# EAGLE design SUDEPDEVICE (EAGLE 9.6.2)
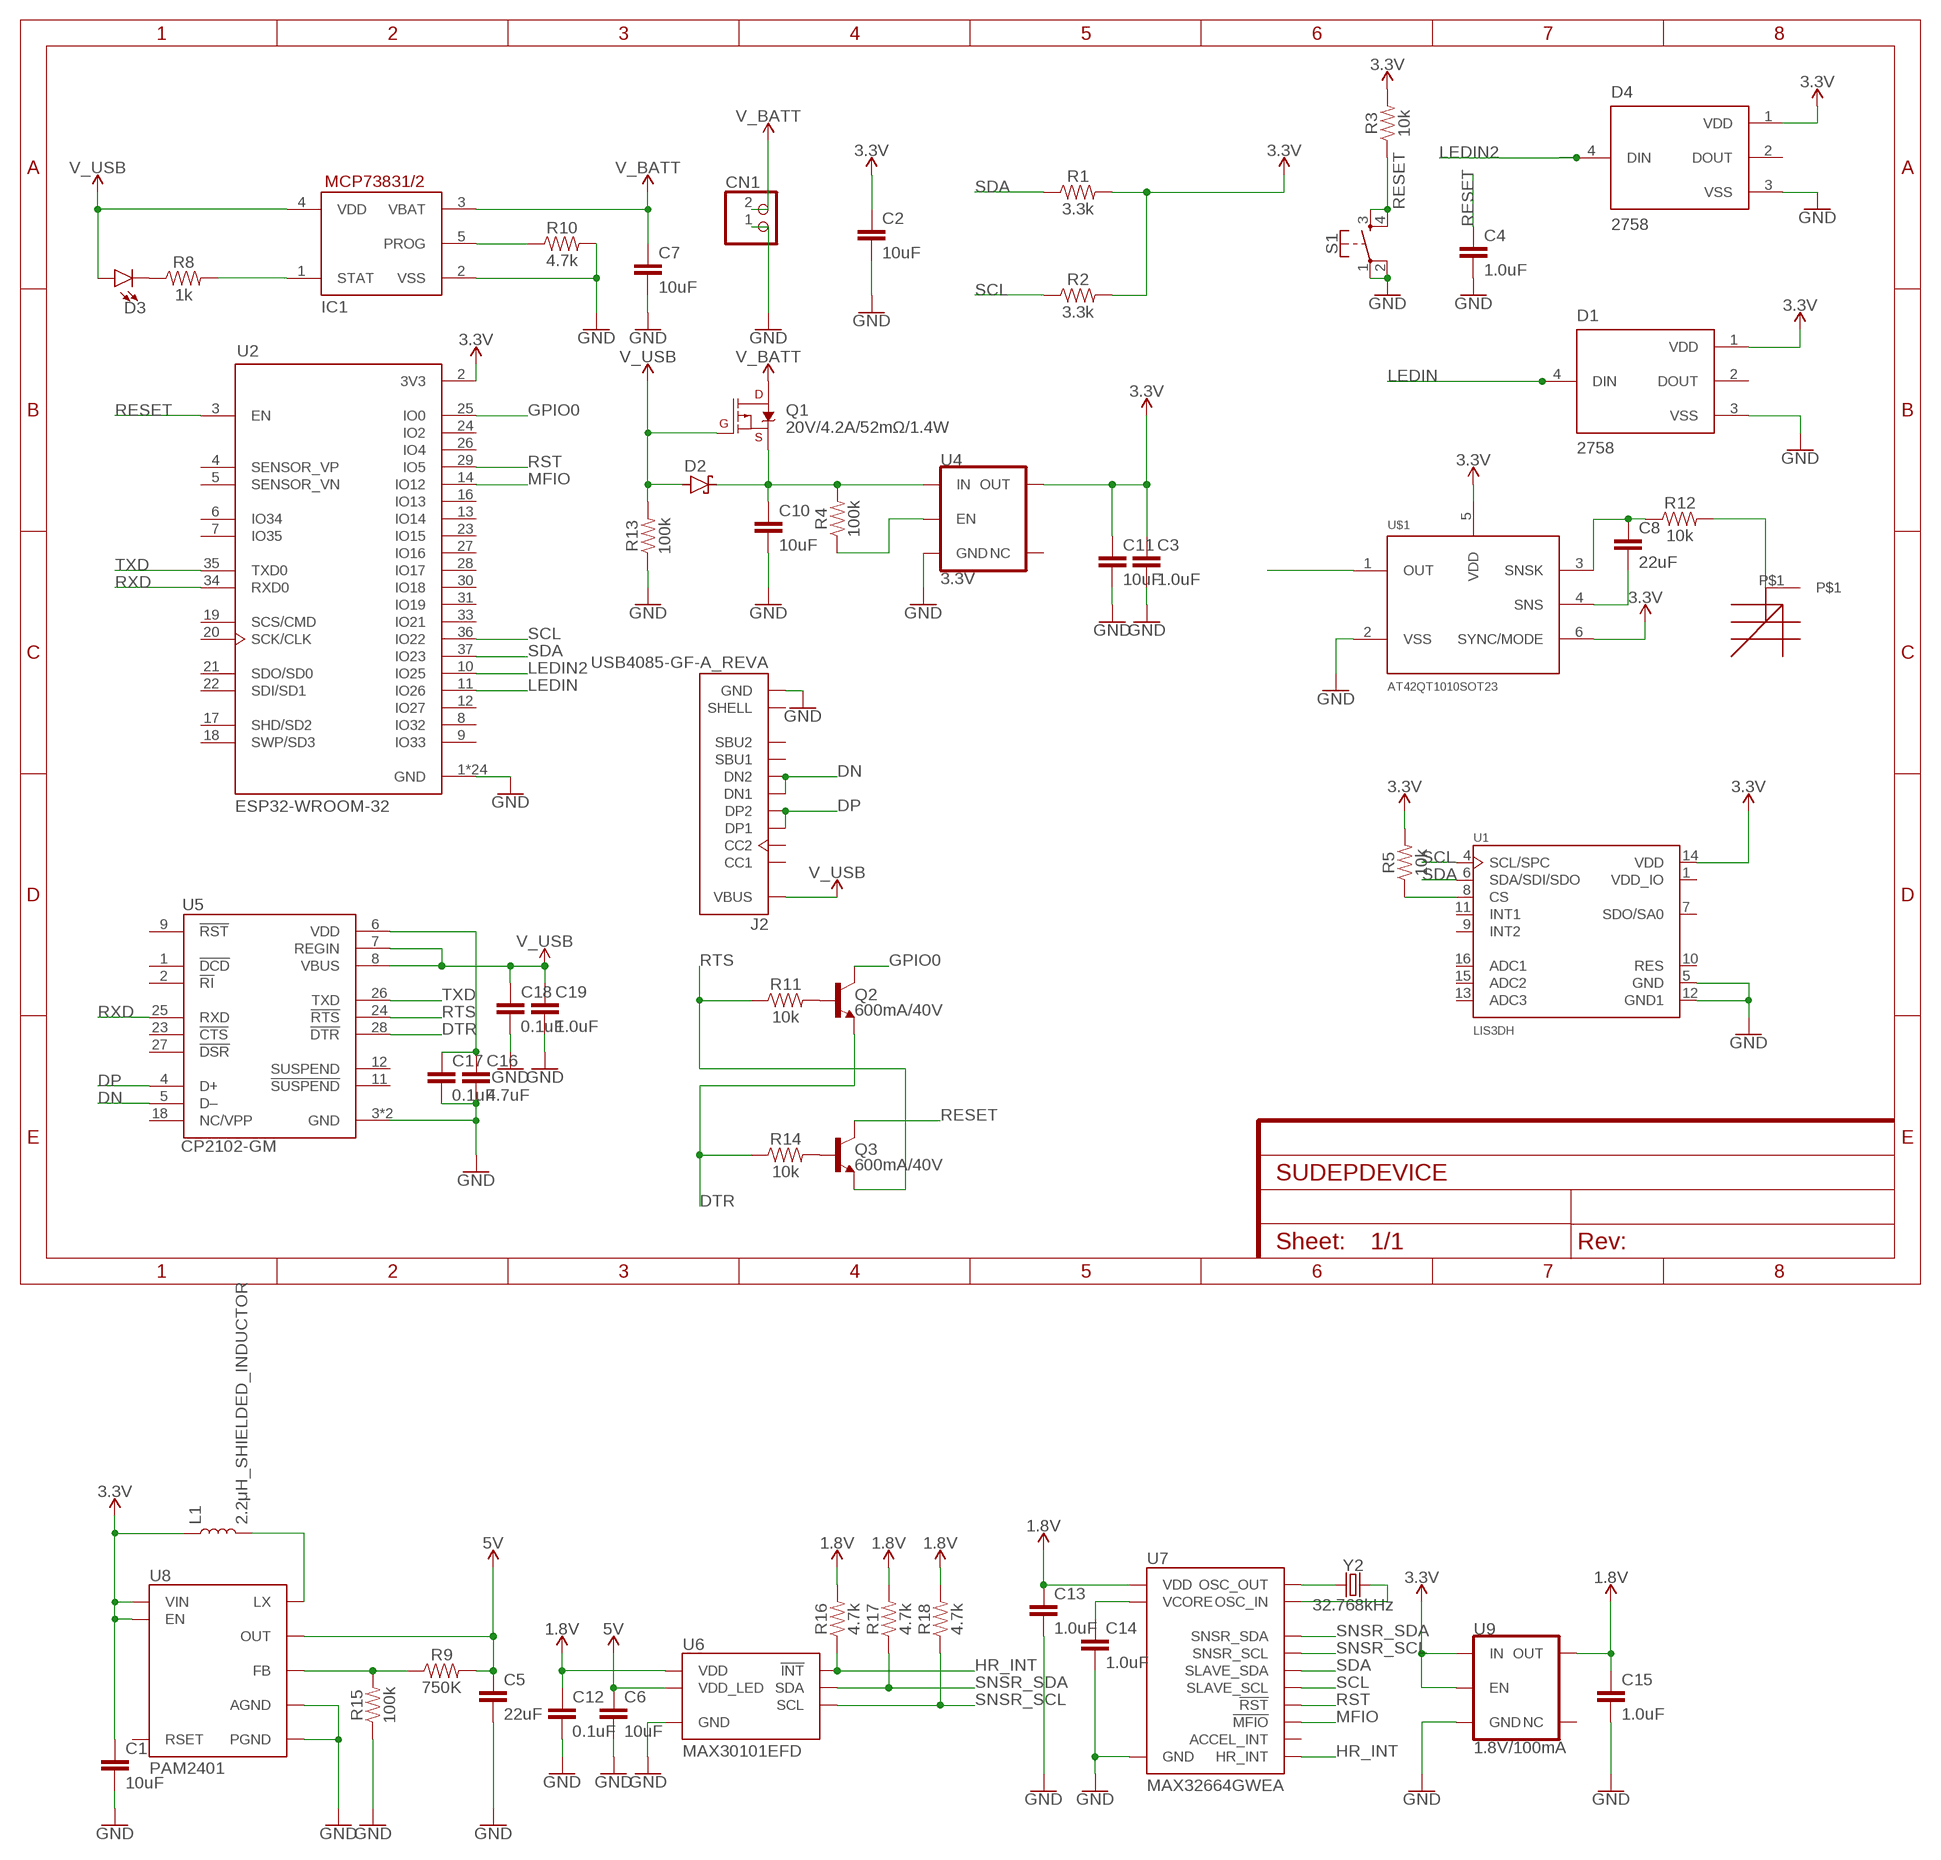
[diagram p0: schematic, sheet 1]

## Parts
C1  10uF  10UF-0603-6.3V-20%  [0603]
C2  10uF  10UF-0603-6.3V-20%  [0603]
C3  1.0uF  1.0UF-0603-16V-10%  [0603]
C4  1.0uF  1.0UF-0603-16V-10%  [0603]
C5  22uF  22UF-0603-6.3V-20%  [0603]
C6  10uF  10UF-0603-6.3V-20%  [0603]
C7  10uF  10UF-0603-6.3V-20%  [0603]
C8  22uF  22UF-0603-6.3V-20%  [0603]
C10  10uF  10UF-0603-6.3V-20%  [0603]
C11  10uF  10UF-0603-6.3V-20%  [0603]
C12  0.1uF  0.1UF-0603-25V-5%  [0603]
C13  1.0uF  1.0UF-0603-16V-10%  [0603]
C14  1.0uF  1.0UF-0603-16V-10%  [0603]
C15  1.0uF  1.0UF-0603-16V-10%  [0603]
C16  4.7uF  4.7UF-0603-6.3V-(10%)  [0603]
C17  0.1uF  0.1UF-0603-25V-(+80/-20%)  [0603]
C18  0.1uF  0.1UF-0603-25V-(+80/-20%)  [0603]
C19  1.0uF  1.0UF-0603-16V-10%  [0603]
CN1  JST_2PIN-SMT-RA  [JST-PH-2-SMT-RA]
D1  2758  [SOL320P540X170-4N]
D2  SCHOTTKY-DIODESMD  [SMB]
D3  LED0603  [LED-0603]
D4  2758  [SOL320P540X170-4N]
IC1  MCP73831/OT  [SOT23-5L]
J2  USB4085-GF-A_REVA  [GCT_USB4085-GF-A_REVA]
L1  2.2μH_SHIELDED_INDUCTOR  [0806]
Q1  20V/4.2A/52mΩ/1.4W  MOSFET_PCH-DMG2305UX-7  [SOT23-3]
Q2  600mA/40V  TRANS_NPN-MMBT2222AL  [SOT23-3]
Q3  600mA/40V  TRANS_NPN-MMBT2222AL  [SOT23-3]
R1  3.3k  3.3KOHM-0603-1/10W-1%  [0603]
R2  3.3k  3.3KOHM-0603-1/10W-1%  [0603]
R3  10k  10KOHM-0603-1/10W-1%  [0603]
R4  100k  100KOHM-0603-1/10W-1%  [0603]
R5  10k  10KOHM-0603-1/10W-1%  [0603]
R8  1k  1KOHM-0603-1/10W-1%  [0603]
R9  750K  750KOHM-0603-1/10W-1%  [0603]
R10  4.7k  4.7KOHM-0603-1/10W-1%  [0603]
R11  10k  10KOHM-0603-1/10W-1%  [0603]
R12  10k  10KOHM-0603-1/10W-1%  [0603]
R13  100k  100KOHM-0603-1/10W-1%  [0603]
R14  10k  10KOHM-0603-1/10W-1%  [0603]
R15  100k  100KOHM-0603-1/10W-1%  [0603]
R16  4.7k  4.7KOHM-0603-1/10W-1%  [0603]
R17  4.7k  4.7KOHM-0603-1/10W-1%  [0603]
R18  4.7k  4.7KOHM-0603-1/10W-1%  [0603]
S1  MOMENTARY-SWITCH-SPST-2-SMD-4.6X2.8MM  [TACTILE_SWITCH_SMD_4.6X2.8MM]
U1  LIS3DH  [PQFN50P300X300X100-16N]
U2  ESP32-WROOM-32  [MODULE_ESP32-WROOM-32]
U4  3.3V  V_REG_AP2112K-3.3V  [SOT23-5]
U5  CP2102-GM  [QFN50P500X500X100-29N]
U6  MAX30101EFD  [14_PIN_OESIP]
U7  MAX32664GWEA  [16_PIN_WLP]
U8  PAM2401  [MSOP8]
U9  1.8V/100mA  V_REG_SP6214-1.8V  [SC70]
U$1  AT42QT1010SOT23  [SOT23-6]
U$2  RMARTIN-CUSTOM-LIBRARY_CAP_SENSOR_5X10  [RMARTIN-CUSTOM-LIBRARY_CAP_SENSOR_5X10]
Y2  32.768kHz  CRYSTAL-32.768KHZSMD-3.2X1.5  [CRYSTAL-SMD-3.2X1.5MM]

## Nets
1.8V: C12.1 C13.1 C15.1 R16.2 R17.2 R18.2 U6.P11(VDD) U7.3(VDD) U9.5(OUT)
3.3V: C1.1 C2.1 C3.1 C11.1 D1.1(VDD) D4.1(VDD) L1.1 R1.2 R2.2 R3.2 R5.2 U1.14(VDD) U2.2(3V3) U4.5(OUT) U8.2(EN) U8.3(VIN) U9.1(IN) U9.3(EN) U$1.5(VDD) U$1.6(SYNC/MODE)
5V: C5.1 C6.1 R9.2 U6.P9(VDD_LED) U6.P10(VDD_LED) U8.7(OUT)
DN: J2.A7(DN1) J2.B7(DN2) U5.5(D–)
DP: J2.A6(DP1) J2.B6(DP2) U5.4(D+)
DTR: Q2.2(E) R14.1 U5.28(!DTR)
GND: C1.2 C2.2 C3.2 C4.2 C5.2 C6.2 C7.2 C10.2 C11.2 C12.2 C13.2 C14.2 C15.2 C16.2 C17.2 C18.2 C19.2 CN1.1 D1.3(VSS) D4.3(VSS) IC1.2(VSS) J2.A1(GND) J2.A12(GND) J2.B1(GND) J2.B12(GND) R10.2 R13.1 R15.1 S1.1 S1.2 U1.5(GND) U1.12(GND1) U2.1(GND) U2.15(GND) U2.38(GND) U2.39_1(GND) U2.39_2(GND) U2.39_3(GND) U2.39_4(GND) U2.39_5(GND) U2.39_6(GND) U2.39_7(GND) U2.39_8(GND) U2.39_9(GND) U2.39_10(GND) U2.39_11(GND) U2.39_12(GND) U2.39_13(GND) U2.39_14(GND) U2.39_15(GND) U2.39_16(GND) U2.39_17(GND) U2.39_18(GND) U2.39_19(GND) U2.39_20(GND) U2.39_21(GND) U4.2(GND) U5.3(GND) U5.29(GND) U6.P4(GND) U6.P12(GND) U7.13(GND) U8.4(AGND) U8.8(PGND) U9.2(GND) U$1.2(VSS)
GPIO0: Q2.3(C) U2.25(IO0)
HR_INT: R16.1 U6.P13(!INT) U7.6(HR_INT)
LEDIN: D1.4(DIN) U2.11(IO26)
LEDIN2: D4.4(DIN) U2.10(IO25)
MFIO: U2.14(IO12) U7.16(!MFIO)
N$1: R4.1 U4.3(EN)
N$3: R9.1 R15.2 U8.5(FB)
N$4: C10.1 D2.C Q1.2(S) R4.2 U4.1(IN)
N$5: IC1.5(PROG) R10.1
N$6: R5.1 U1.8(CS)
N$7: IC1.1(STAT) R8.2
N$8: C8.2 U$1.4(SNS)
N$9: Q2.1(B) R11.2
N$10: Q3.1(B) R14.2
N$11: D3.C R8.1
N$12: C8.1 R12.1 U$1.3(SNSK)
N$13: U$1.1(OUT)
N$15: R12.2 U$2.P$1
N$16: L1.2 U8.1(LX)
N$17: C14.1 U7.4(VCORE)
N$18: U7.1(OSC_OUT) Y2.P$1
N$19: U7.2(OSC_IN) Y2.P$2
N$20: C16.1 C17.1 U5.6(VDD)
RESET: C4.1 Q3.3(C) R3.1 S1.3 S1.4 U2.3(EN)
RST: U2.29(IO5) U7.12(!RST)
RTS: Q3.2(E) R11.1 U5.24(!RTS)
RXD: U2.34(RXD0) U5.25(RXD)
SCL: R2.1 U1.4(SCL/SPC) U2.36(IO22) U7.10(SLAVE_SCL)
SDA: R1.1 U1.6(SDA/SDI/SDO) U2.37(IO23) U7.9(SLAVE_SDA)
SNSR_SCL: R18.1 U6.P2(SCL) U7.5(SNSR_SCL)
SNSR_SDA: R17.1 U6.P3(SDA) U7.14(SNSR_SDA)
TXD: U2.35(TXD0) U5.26(TXD)
V_BATT: C7.1 CN1.2 IC1.3(VBAT) Q1.3(D)
V_USB: C18.1 C19.1 D2.A D3.A IC1.4(VDD) J2.A4(VBUS) J2.A9(VBUS) J2.B4(VBUS) J2.B9(VBUS) Q1.1(G) R13.2 U5.7(REGIN) U5.8(VBUS)
Unconnected: D1.2(DOUT) D4.2(DOUT) J2.A5(CC1) J2.A8(SBU1) J2.B5(CC2) J2.B8(SBU2) J2.P1(SHELL) J2.P2(SHELL) J2.P3(SHELL) J2.P4(SHELL) U1.7(SDO/SA0) U1.9(INT2) U1.11(INT1) U1.13(ADC3) U1.15(ADC2) U1.16(ADC1) U2.4(SENSOR_VP) U2.5(SENSOR_VN) U2.6(IO34) U2.7(IO35) U2.8(IO32) U2.9(IO33) U2.12(IO27) U2.13(IO14) U2.16(IO13) U2.17(SHD/SD2) U2.18(SWP/SD3) U2.19(SCS/CMD) U2.20(SCK/CLK) U2.21(SDO/SD0) U2.22(SDI/SD1) U2.23(IO15) U2.24(IO2) U2.26(IO4) U2.27(IO16) U2.28(IO17) U2.30(IO18) U2.31(IO19) U2.33(IO21) U4.4(NC) U5.1(!DCD) U5.2(!RI) U5.9(!RST) U5.11(!SUSPEND) U5.12(SUSPEND) U5.18(NC/VPP) U5.23(!CTS) U5.27(!DSR) U7.15(ACCEL_INT) U8.6(RSET) U9.4(NC)

## Power pins joined to a net without a drawn wire
RES: U1.10(RES)
VDD_IO: U1.1(VDD_IO)

## Library data of the parts
C1 C2 C6 C7 C10 C11 = SparkFun-Capacitors:10UF: 10.0µF ceramic capacitors A capacitor is a passive two-terminal electrical component used to store electrical energy temporarily in an electric field.; PROD_ID: CAP-11015
C3 C4 C13-C15 C19 = SparkFun-Capacitors:1.0UF: 1µF ceramic capacitors A capacitor is a passive two-terminal electrical component used to store electrical energy temporarily in an electric field.; PROD_ID: CAP-00868
C5 C8 = SparkFun-Capacitors:22UF: 22µF ceramic capacitors A capacitor is a passive two-terminal electrical component used to store electrical energy temporarily in an electric field.; PROD_ID: CAP-14464
C12 = SparkFun-Capacitors:0.1UF: 0.1µF ceramic capacitors A capacitor is a passive two-terminal electrical component used to store electrical energy temporarily in an electric field.; PROD_ID: CAP-08604
C16 = SparkFun-Capacitors:4.7UF: 4.7µF ceramic capacitors A capacitor is a passive two-terminal electrical component used to store electrical energy temporarily in an electric field.; PROD_ID: CAP-08280
C17 C18 = SparkFun-Capacitors:0.1UF: 0.1µF ceramic capacitors A capacitor is a passive two-terminal electrical component used to store electrical energy temporarily in an electric field.; PROD_ID: CAP-00810
CN1 = adafruit:JST_2PIN: JST 2-Pin Connectors of various flavors SMT-RA (S2B-PH-SM4) 4UConnector #17311 SMT (B2B-PH-SM4) THM-RA (S2B-PH) THM (B2B-PH)
D1 D4 = 2758:2758: NeoPixel RGBW LEDs w/ Integrated DriverChip - Natural White - 4500K - White Ca Check prices <https://pricing.snapeda.com/parts/2758/Adafruit%20Industries/view-part?ref=eda>; AVAILABILITY: In Stock; DESCRIPTION: NeoPixel RGBW LEDs w/ Integrated DriverChip - Natural White - 4500K - White Ca; MF: Adafruit Industries; MP: 2758; PACKAGE: SMD-4 Adafruit Industries; PRICE: None; PURCHASE-URL: https://pricing.snapeda.com/search/part/2758/?ref=eda
D2 = diode:SCHOTTKY-DIODE: Schottky Diode
D3 = SparkFun-LED:LED: LED (Generic) Standard schematic elements and footprints for 5mm, 3mm, 1206, and 0603 sized LEDs. Generic LEDs with no color specified.
IC1 = adafruit:MCP73831: MCP73831/2 Miniature Single-Cell, Fully Integrated Li-Ion, Li-Polymer Charge Management Controllers. Nice and small simple lipoly charge controller, with adjustable current and status output (LED) http://www.ladyada.net/library/pcb/eaglelibrary.html
J2 = USB4085-GF-A_REVA:USB4085-GF-A_REVA: USB 2.0 Type C Receptacle Dip Type, PCB Top Mount Check prices <https://pricing.snapeda.com/parts/USB4085-GF-A/Global%20Connector%20Technology/view-part?ref=eda>; AVAILABILITY: In Stock; DESCRIPTION: USB-C (USB TYPE-C) USB 2.0 Receptacle Connector 24 (16+8 Dummy) Position Through Hole, Right Angle, low cost, 3.46mm profile, 16 pin, horizontal, Top mount; MF: Global Connector Technology; MP: USB4085-GF-A; PACKAGE: None; PRICE: None; PURCHASE-URL: https://pricing.snapeda.com/search/part/USB4085-GF-A/?ref=eda
L1 = SparkFun-Coils:2.2μH_SHIELDED_INDUCTOR: Murata 2.2uH Inductor 2.2uH 1.2A 110mOhm 0806 Package Shielded Bourns 2.2uH Inductor 2.2uH 5.5A 205mOhm 5x5mm Package Shielded; PROD_ID: NDUC-14257
Q1 = SparkFun-DiscreteSemi:MOSFET_PCH: P-channel MOSFETs Voltage controlled devices that allow control of high current outputs. SparkFun Products: SparkFun ESP32 Thing <https://www.sparkfun.com/products/13907> SparkFun ESP8266 Thing <https://www.sparkfun.com/products/13231> SparkFun Pi Servo HAT V2 <https://www.sparkfun.com/products/15316> DMG2305UX-7 (20V/4.2A/SOT23-3); PROD_ID: TRANS-14388
Q2 Q3 = SparkFun-DiscreteSemi:TRANS_NPN: NPN transistor Current controlled devices typically used to amplify current or used as a switch. BC547 - COM-08928 <http://www.sparkfun.com/products/8928> (TO-92 45V 100mA) (1.Collector 2.Base 3.Emitter) 2N3904 - COM-00521 <http://www.sparkfun.com/products/521> (TO-92 40V 200mA) (1.Emitter 2.Base 3.Collector) P2N2222A - COM-12852 <http://www.sparkfun.com/products/12852> (TO-92 40V 600mA) (1.Collector 2.Base 3.Emitter); PROD_ID: TRANS-08049
R1 R2 = SparkFun-Resistors:3.3KOHM: 3.3kΩ resistor A resistor is a passive two-terminal electrical component that implements electrical resistance as a circuit element. Resistors act to reduce current flow, and, at the same time, act to lower voltage levels within circuits. - Wikipedia; PROD_ID: RES-07851
R3 R5 R11 R12 R14 = SparkFun-Resistors:10KOHM: 10kΩ resistor A resistor is a passive two-terminal electrical component that implements electrical resistance as a circuit element. Resistors act to reduce current flow, and, at the same time, act to lower voltage levels within circuits. - Wikipedia; PROD_ID: RES-00824
R4 R13 R15 = SparkFun-Resistors:100KOHM: 100kΩ resistor A resistor is a passive two-terminal electrical component that implements electrical resistance as a circuit element. Resistors act to reduce current flow, and, at the same time, act to lower voltage levels within circuits. - Wikipedia; PROD_ID: RES-07828
R8 = SparkFun-Resistors:1KOHM: 1kΩ resistor A resistor is a passive two-terminal electrical component that implements electrical resistance as a circuit element. Resistors act to reduce current flow, and, at the same time, act to lower voltage levels within circuits. - Wikipedia; PROD_ID: RES-07856
R9 = SparkFun-Resistors:750KOHM: 750Ω resistor A resistor is a passive two-terminal electrical component that implements electrical resistance as a circuit element. Resistors act to reduce current flow, and, at the same time, act to lower voltage levels within circuits. - Wikipedia; PROD_ID: RES-13768
R10 R16-R18 = SparkFun-Resistors:4.7KOHM: 4.7kΩ resistor A resistor is a passive two-terminal electrical component that implements electrical resistance as a circuit element. Resistors act to reduce current flow, and, at the same time, act to lower voltage levels within circuits. - Wikipedia; PROD_ID: RES-07857
S1 = SparkFun-Switches:MOMENTARY-SWITCH-SPST-2: Momentary Switch (Pushbutton) - SPST - Two Circuits Normally-open (NO) SPST momentary switches (buttons, pushbuttons). Schematic symbol includes two switch circuits. Variants SMD-4.6MMX2.8MM - 4.60mm x 2.80mm Tactile Momentary Button Switch - Used on SparkFun Pro Micro - RP2040 <https://www.sparkfun.com/products/17717> SMD-5.2MM - Mini Pushbutton Switch - SMD <https://www.sparkfun.com/products/8720> - Used on Arduino Pro Mini <https://www.sparkfun.com/products/11114>; PROD_ID: SWCH-15606
U1 = LIS3DH:LIS3DH: MEMS digital output motion sensor ultra low-power high performance 3-axes "nano" accelerometer Check prices <https://pricing.snapeda.com/parts/LIS3DH/STMicroelectronics/view-part?ref=eda>; AVAILABILITY: Not in stock; DESCRIPTION: Accelerometer X, Y, Z Axis ±2g, 4g, 8g, 16g 0.5Hz ~ 625Hz 16-LGA (3x3); MF: STMicroelectronics; MP: LIS3DH; PACKAGE: LGA-16 STMicroelectronics; PRICE: None
U2 = ESP32-WROOM-32:ESP32-WROOM-32: Bluetooth, WiFi Transceiver Module 2.4GHz ~ 2.5GHz Surface Mount Check prices <https://pricing.snapeda.com/parts/ESP32-WROOM-32/Espressif%20Systems/view-part?ref=eda>; AVAILABILITY: In Stock; DESCRIPTION: Bluetooth, WiFi 802.11b/g/n, Bluetooth v4.2 +EDR, Class 1, 2 and 3 Transceiver Module 2.4GHz ~ 2.5GHz Antenna Not Included, U.FL Surface Mount; MF: Espressif Systems; MP: ESP32-WROOM-32; PACKAGE: Module Espressif Systems; PRICE: None; PURCHASE-URL: https://pricing.snapeda.com/search/part/ESP32-WROOM-32/?ref=eda
U4 = SparkFun-IC-Power:V_REG_AP2112: AP2112 - 600mA CMOS LDO Regulator w/ Enable The AP2112 is CMOS process low dropout linear regulator with enable function, the regulator delivers a guaranteed 600mA (min.) continuous load current. Features Output Voltage Accuracy: ±1.5% Output Current: 600mA (Min.) Foldback Short Current Protection: 50mA Enable Function to Turn ON/OFF VOUT Low Dropout Voltage (3.3V): 250mV (Typ.) @IOUT=600mA Excellent Load Regulation: 0.2%/A (Typ.) Excellent Line Regulation: 0.02%/V (Typ.) Low Quiescent Current: 55μA (Typ.) Low Standby Current: 0.01μA (Typ.) Low Output Noise: 50μVRMS PSRR: 100Hz -65dB, 1kHz -65dB OTSD Protection Stable with 1.0μF Flexible Cap: Ceramic, Tantalum and Aluminum Electrolytic Operation Temperature Range: -40°C to 85°C ESD: MM 400V, HBM 4000V; PROD_ID: VREG-12457
U5 = CP2102-GM:CP2102-GM: IC USB-TO-UART BRIDGE 28VQFN Check prices <https://pricing.snapeda.com/parts/CP2102GM/Silicon%20Labs/view-part?ref=eda>; AVAILABILITY: In Stock; DESCRIPTION: USB Bridge, USB to UART USB 2.0 UART Interface 28-QFN (5x5); MF: Silicon Labs; MP: CP2102GM; PACKAGE: VFQFN-28 Vishay Siliconix; PRICE: None
U6 = SparkFun-IC-Special-Function:MAX30101EFD: MAX30101 High-Sensitivity Pulse Oximeter and Heart-Rate Sensor The MAX30101 is an integrated pulse oximetry and heart-rate monitor module. It includes internal LEDs, photodetectors, optical elements, and low-noise electronics with ambient light rejection. The MAX30101 provides a complete system solution to ease the design-in process for mobile and wearable devices. The MAX30101 operates on a single 1.8V power supply and a separate 5.0V power supply for the internal LEDs. Communication is through a standard I2C-compatible interface. The module can be shut down through software with zero standby current, allowing the power rails to remain powered at all times; PROD_ID: IC-14270
U7 = SparkFun-IC-Special-Function:MAX32664GWEA: Maxim MAX32664 Biometric Sensor Hub he MAX32664 is a sensor hub family with embedded firmware and algorithms for wearables. It seamlessly enables customer-desired sensor functionality, including communication with Maxim’s optical sensor solutions and delivering raw or calculated data to the outside world. This is achieved while keeping overall system power consumption in check. The MAX32664 Version A supports the MAX30101/ MAX30102 high-sensitivity pulse oximeter and heart rate sensor for wearable health for finger-based applications.; PROD_ID: IC-14271
U8 = SparkFun-IC-Power:PAM2401: PAM2401 - Boost PMIC Specifications: Up to 1A output current 0.9V to 4.75V Input Range 2.5V to 5.0V Adjustable Output Voltage Datasheet <https://www.diodes.com/assets/Datasheets/PAM2401.pdf> (Diodes inc.); PROD_ID: IC-13769
U9 = SparkFun-IC-Power:V_REG_SP6214: Voltage Regulator - SP6214 SP6214 Series SC-70-5 Micropower SC-70 100 mA CMOS LDO Regulator Datasheet <https://www.exar.com/content/document.ashx?id=654> SparkFun Products: MP3 Trigger <https://www.sparkfun.com/products/13720> SparkFun Particle Sensor Breakout <https://www.sparkfun.com/products/14045>; PROD_ID: VREG-08428
U$1 = SparkFun-Sensors:AT42QT1010: Atmel AT42QT1010 The AT42QT1010 (QT1010) is a digital burst mode charge-transfer (QT™) sensor that is capable of detecting nearproximityor touch, making it ideal for implementing touch controls.The QT1010 is designed specifically for human interfaces, like control panels, appliances, toys, lighting controls, or anywhere a mechanical switch or button may be found. It includes all hardware and signal processing functions necessary to provide stable sensing under a wide variety of changing conditions. Only a single low-cost capacitor is required for operation. Datasheet <http://www.atmel.com/images/Atmel-9541-AT42-QTouch-BSW-AT42QT1010_Datasheet.pdf> Sparkfun Products Sparkfun Capacitive Touch Breakout <https://www.sparkfun.com/products/12041> (SEN-12041)
U$2 = UD_Sediment_Capacitance_12Ch_revB:RMARTIN-CUSTOM-LIBRARY_CAP_SENSOR_5X10
Y2 = SparkFun-Clocks:CRYSTAL-32.768KHZ: 32.768kHz Crystal Frequency: 32.768kHz Frequency Stability: ±20ppm Load Capacitance: 12.5pF (PTH-2X6 & SMD-3.2X1.5), 6pF (SMD-2X6) SparkFun Products: SparkFun BigTime Watch Kit <https://www.sparkfun.com/products/11734> SparkFun nRF52832 Breakout <https://www.sparkfun.com/products/13990> SparkFun Real Time Clock Module <https://www.sparkfun.com/products/12708>; PROD_ID: XTAL-13062

## Board
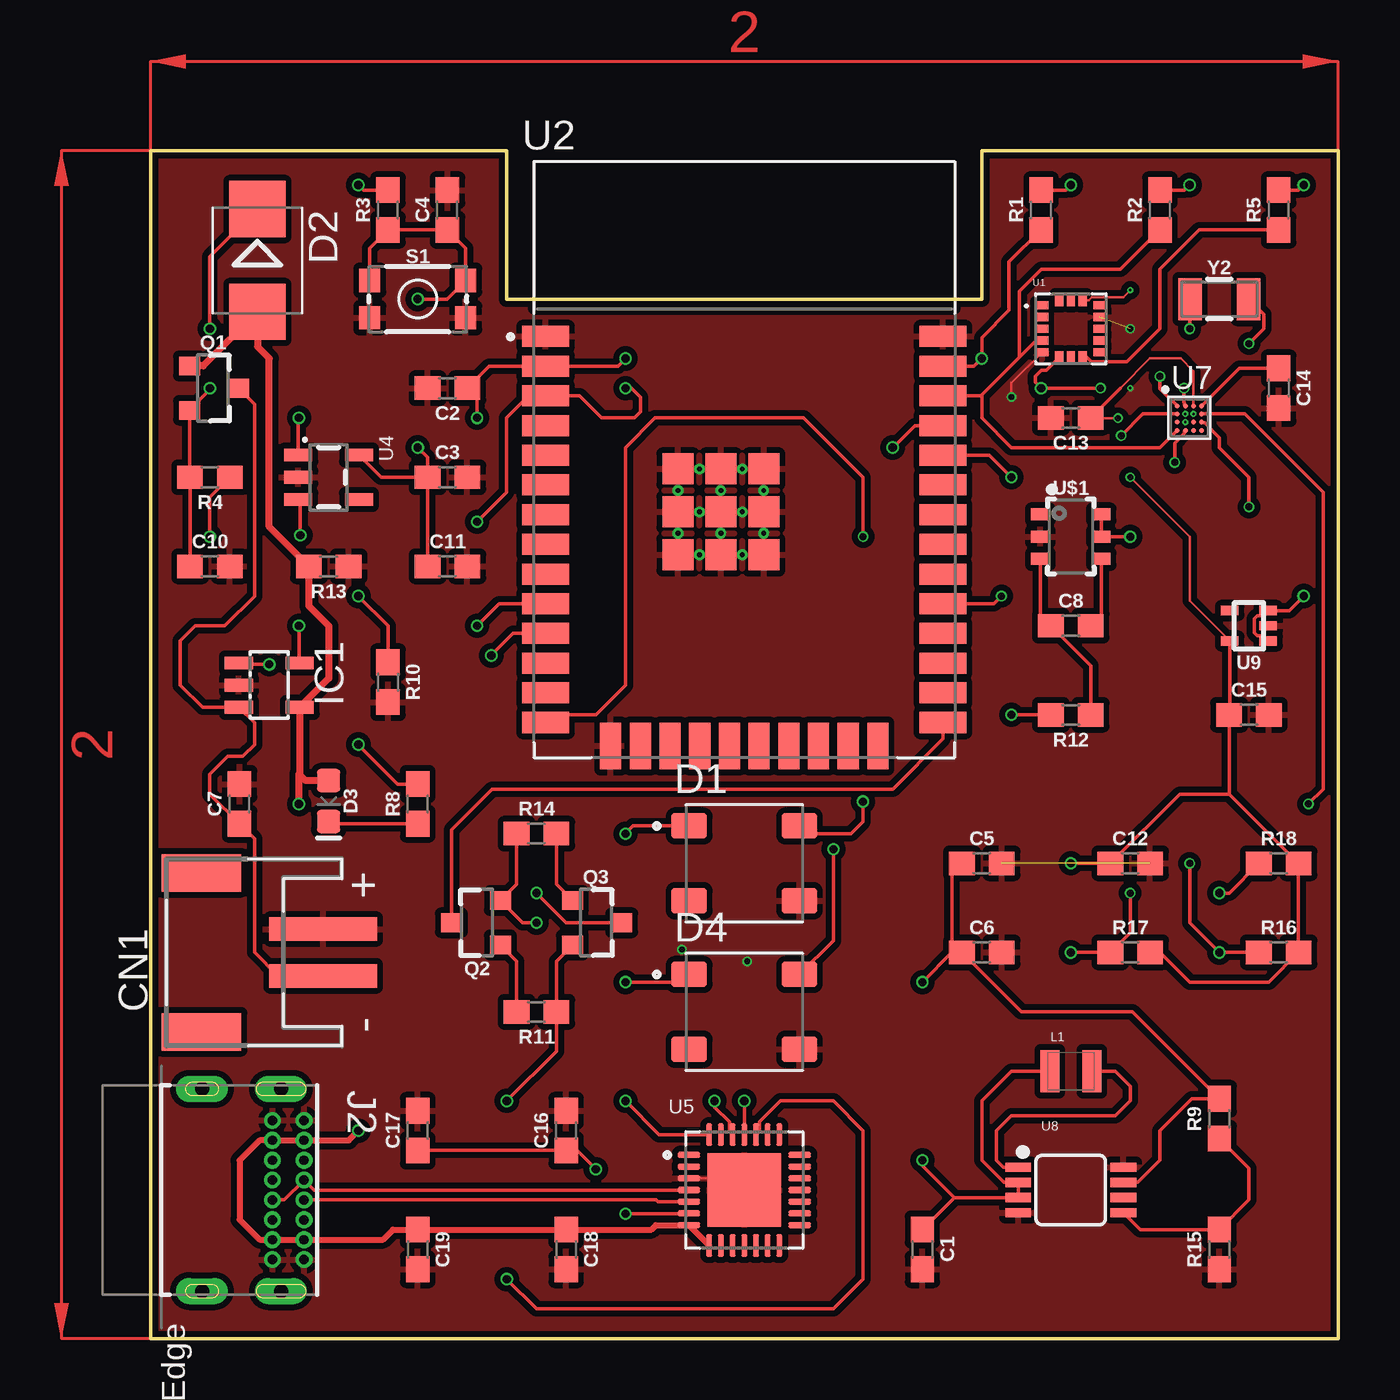
[diagram p1: board, top side]
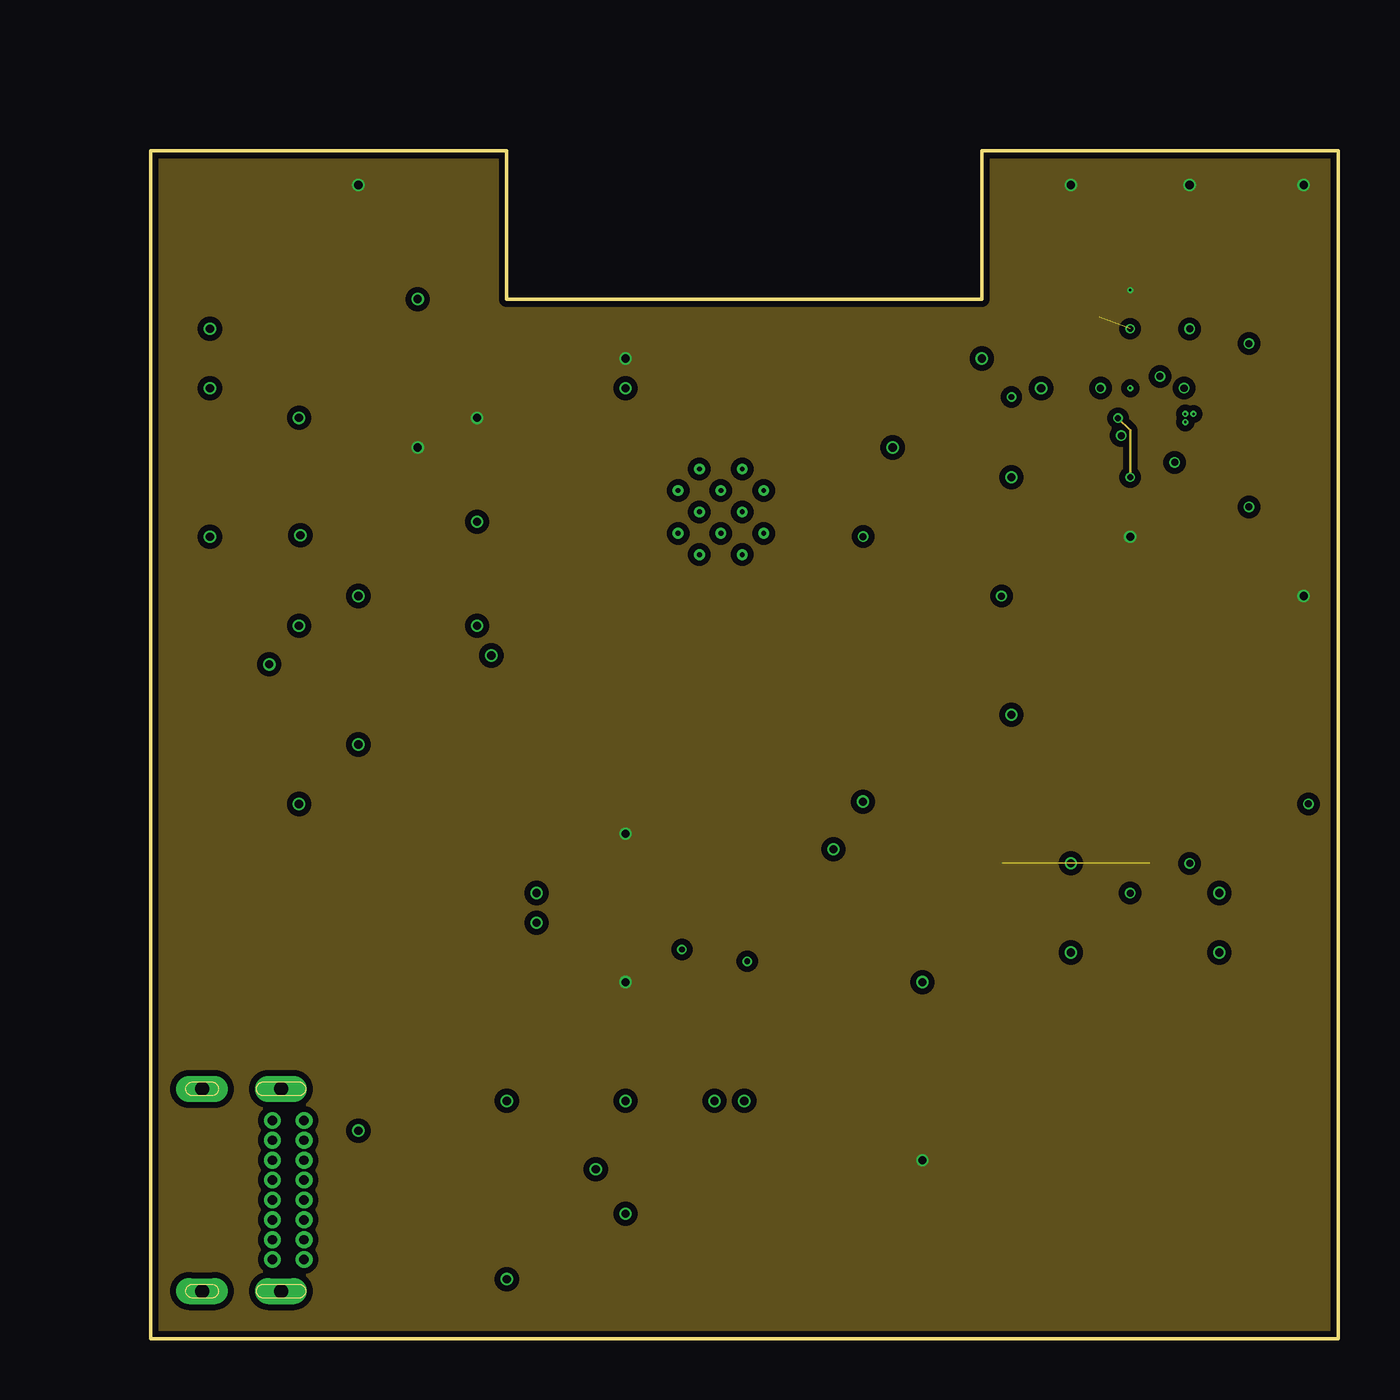
[diagram p2: board, inner layer Route2]
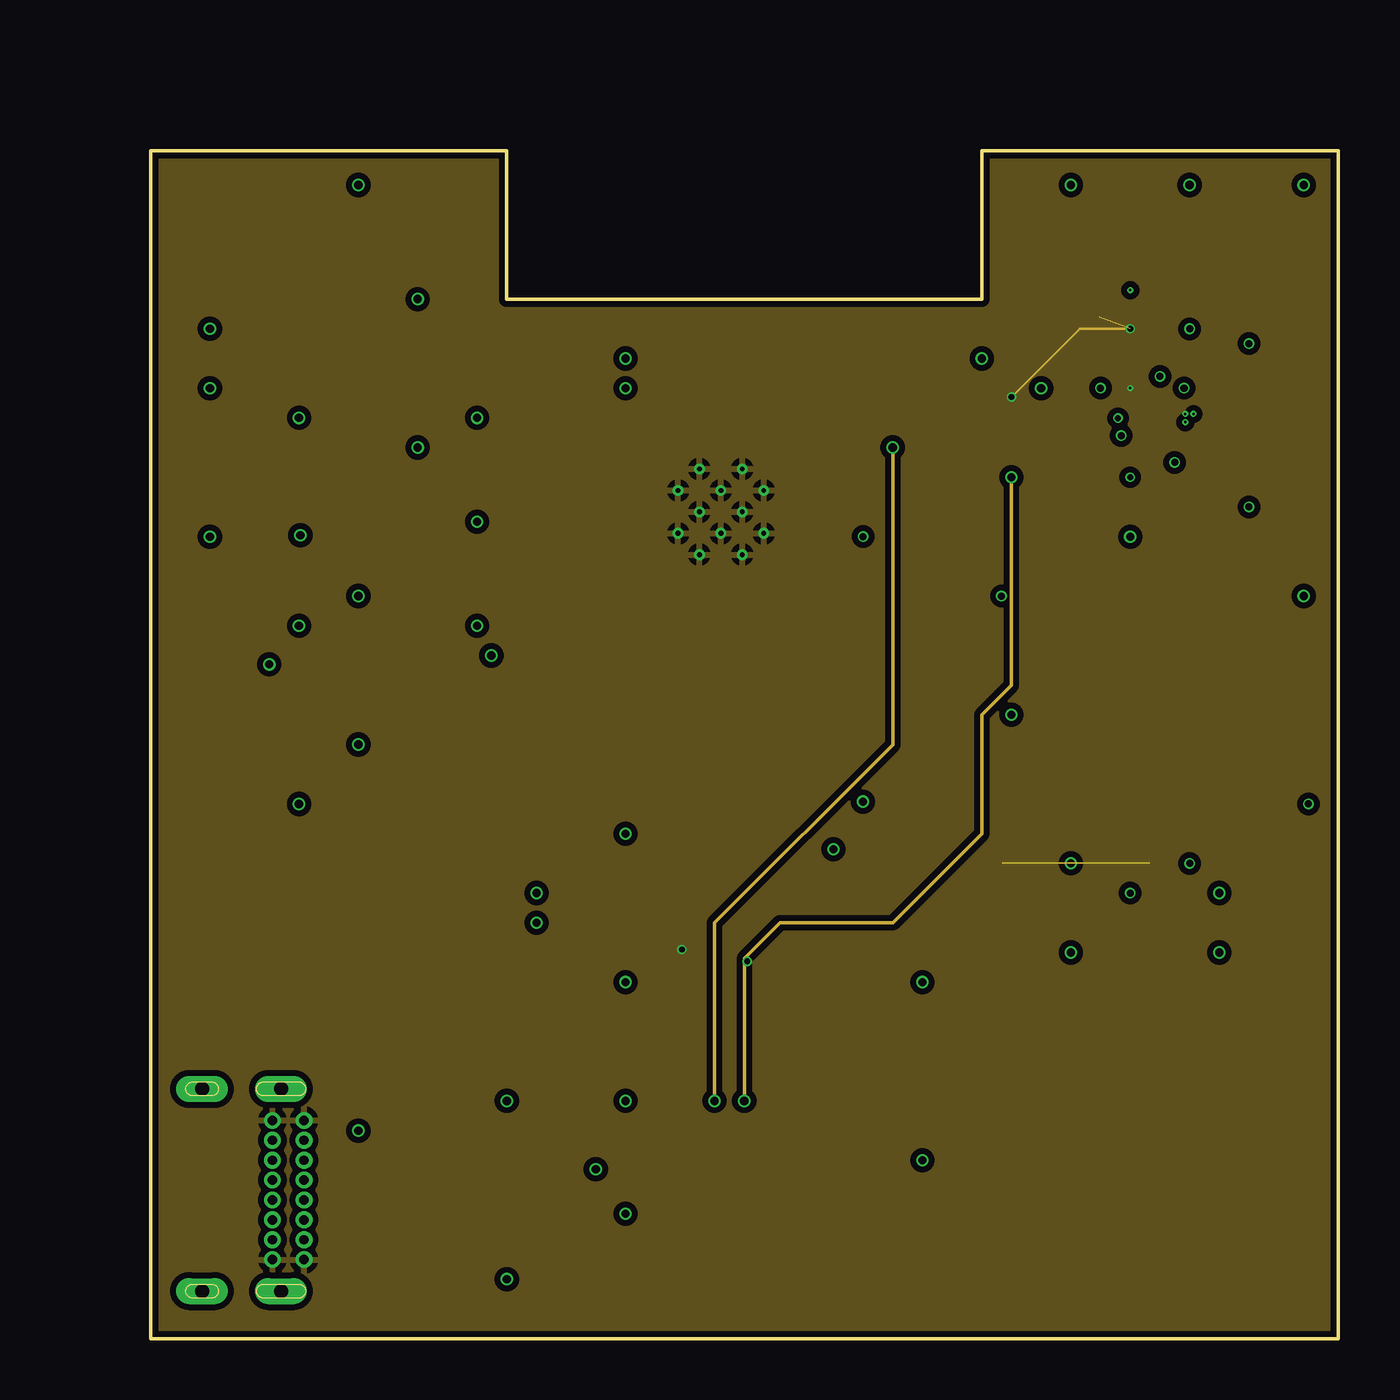
[diagram p3: board, inner layer Route15]
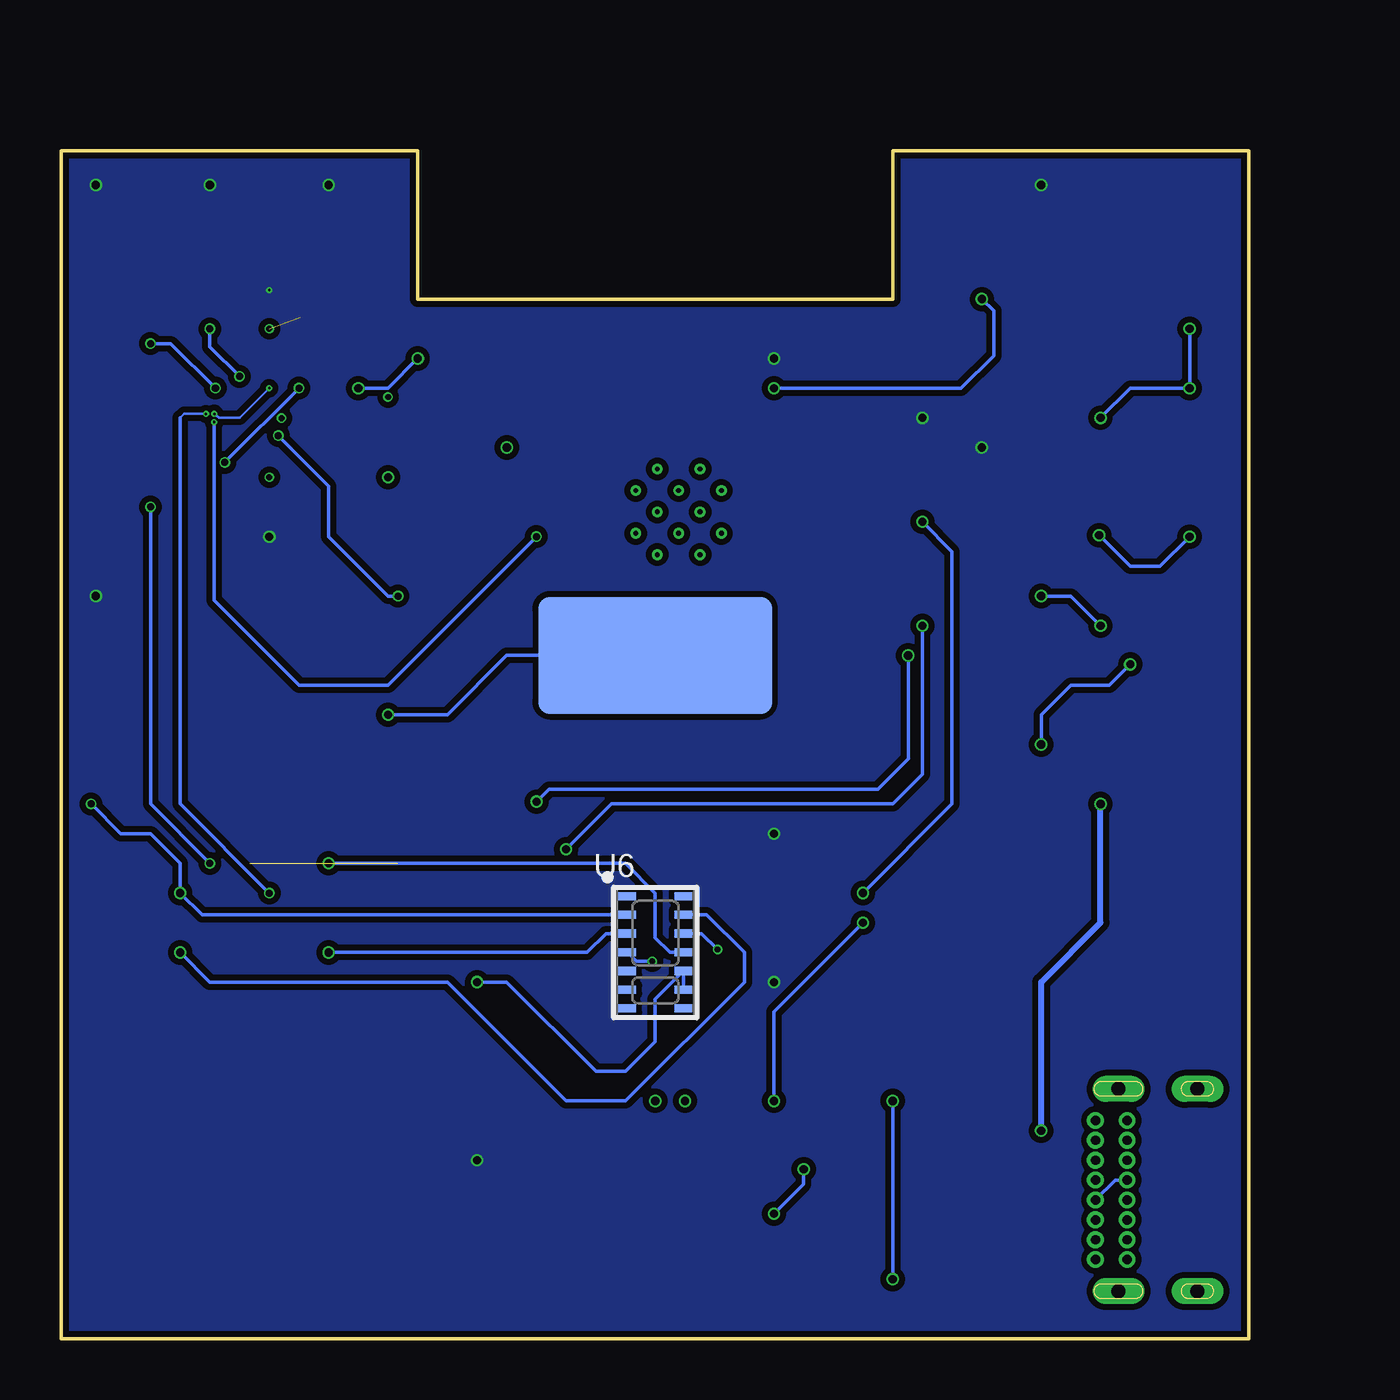
[diagram p4: board, bottom side, seen from below]

Size 50.8 x 50.8 mm. Coordinates in mm from the lower left corner, seen from the top.
Outline: 0,50.8 0,0 50.8,0 50.8,50.8 35.56,50.8 35.56,44.45 15.24,44.45 15.24,50.8 0,50.8
Copper layers (1+2*15+16): Top 0.035mm / dielectric 1.6mm / Route2 0.035mm / dielectric 0.15mm / Route15 0.035mm / dielectric 0.2mm / Bottom 0.035mm
Design rules "jlcpcb-2layers *": minimum track width 4mil, minimum drill 4mil, track to track 4mil, track to pad 5mil, pad to pad 5mil, via to via 4mil, smd to smd 4mil, copper to edge 0.2mm, drill to drill 6mil, minimum pad ring 5mil, minimum via ring 3mil, stop-mask expansion 4mil, vias tented up to drill 0mil, thermal gap 10mil

### Footprints (pad centres in the part's own frame; a part is rotated, then mirrored left to right if it is on the bottom)
0603 = smd 1.1 x 1: 1 -0.85,0; 2 0.85,0
JST-PH-2-SMT-RA = smd 1 x 4.6: 1 1,-3.7; 2 -1,-3.7 | smd 1.6 x 3.4: NC1 -3.4,1.5; NC2 3.4,1.5
SOL320P540X170-4N = smd 1.51 x 1.09: 1 -2.36,1.6; 2 -2.36,-1.6; 3 2.36,-1.6; 4 2.36,1.6
SMB = smd 2.4 x 2.4: A 2.2,0; C -2.2,0
LED-0603 = smd 1 x 1: A -0.877,0; C 0.877,0
SOT23-5L = smd 0.55 x 1.2: 1 -0.95,-1.3; 2 0,-1.3; 3 0.95,-1.3; 4 0.95,1.3; 5 -0.95,1.3
GCT_USB4085-GF-A_REVA = drill 0.4 pad 0.65: A1 -2.975,4.025; A4 -2.125,4.025; A5 -1.275,4.025; A6 -0.425,4.025; A7 0.425,4.025; A8 1.275,4.025; A9 2.125,4.025; A12 2.975,4.025; B1 2.975,2.675; B4 2.125,2.675; B5 1.275,2.675; B6 0.425,2.675; B7 -0.425,2.675; B8 -1.275,2.675; B9 -2.125,2.675; B12 -2.975,2.675 | drill 0.6 pad 1.108 long: P1 -4.325,3.045; P2 4.325,3.045; P3 4.325,-0.335; P4 -4.325,-0.335
0806 = smd 0.8 x 1.8: 1 -0.9,0; 2 0.9,0
SOT23-3 = smd 0.8 x 0.9: 1 -0.95,-1; 2 0.95,-1; 3 0,1.1
TACTILE_SWITCH_SMD_4.6X2.8MM = smd 0.9 x 1: 1 -2.05,-0.8; 2 2.05,-0.8; 3 2.05,0.8; 4 -2.05,0.8
PQFN50P300X300X100-16N = smd 0.52 x 0.35: 1 -1.225,1; 2 -1.225,0.5; 3 -1.225,0; 4 -1.225,-0.5; 5 -1.225,-1; 9 1.225,-1; 10 1.225,-0.5; 11 1.225,0; 12 1.225,0.5; 13 1.225,1 | smd 0.35 x 0.52: 6 -0.5,-1.225; 7 0,-1.225; 8 0.5,-1.225; 14 0.5,1.225; 15 0,1.225; 16 -0.5,1.225
MODULE_ESP32-WROOM-32 = smd 2 x 0.9: 1 -8.5,5.26; 2 -8.5,3.99; 3 -8.5,2.72; 4 -8.5,1.45; 5 -8.5,0.18; 6 -8.5,-1.09; 7 -8.5,-2.36; 8 -8.5,-3.63; 9 -8.5,-4.9; 10 -8.5,-6.17; 11 -8.5,-7.44; 12 -8.5,-8.71; 13 -8.5,-9.98; 14 -8.5,-11.25; 25 8.5,-11.25; 26 8.5,-9.98; 27 8.5,-8.71; 28 8.5,-7.44; 29 8.5,-6.17; 30 8.5,-4.9; 31 8.5,-3.63; 32 8.5,-2.36; 33 8.5,-1.09; 34 8.5,0.18; 35 8.5,1.45; 36 8.5,2.72; 37 8.5,3.99; 38 8.5,5.26 | smd 0.9 x 2: 15 -5.715,-12.25; 16 -4.445,-12.25; 17 -3.175,-12.25; 18 -1.905,-12.25; 19 -0.635,-12.25; 20 0.635,-12.25; 21 1.905,-12.25; 22 3.175,-12.25; 23 4.445,-12.25; 24 5.715,-12.25 | smd 1.33 x 1.33: 39_1 -2.835,-0.405; 39_2 -1,-0.405; 39_3 0.835,-0.405; 39_4 -2.835,-2.24; 39_5 -1,-2.24; 39_6 0.835,-2.24; 39_7 -2.835,-4.075; 39_8 -1,-4.075; 39_9 0.835,-4.075 | drill 0.2 pad 0.3: 39_10 -1.917,-0.405; 39_11 -0.083,-0.405; 39_12 -2.835,-1.323; 39_13 -1,-1.323; 39_14 0.835,-1.323; 39_15 -1.917,-2.24; 39_16 -0.083,-2.24; 39_17 -2.835,-3.158; 39_18 -1,-3.158; 39_19 0.835,-3.158; 39_20 -1.917,-4.075; 39_21 -0.083,-4.075
SOT23-5 = smd 0.55 x 1.2: 1 -0.95,-1.3; 2 0,-1.3; 3 0.95,-1.3; 4 0.95,1.3; 5 -0.95,1.3
QFN50P500X500X100-29N = smd 0.97 x 0.26: 1 -2.37,1.5; 2 -2.37,1; 3 -2.37,0.5; 4 -2.37,0; 5 -2.37,-0.5; 6 -2.37,-1; 7 -2.37,-1.5; 15 2.37,-1.5; 16 2.37,-1; 17 2.37,-0.5; 18 2.37,0; 19 2.37,0.5; 20 2.37,1; 21 2.37,1.5 | smd 0.26 x 0.97: 8 -1.5,-2.37; 9 -1,-2.37; 10 -0.5,-2.37; 11 0,-2.37; 12 0.5,-2.37; 13 1,-2.37; 14 1.5,-2.37; 22 1.5,2.37; 23 1,2.37; 24 0.5,2.37; 25 0,2.37; 26 -0.5,2.37; 27 -1,2.37; 28 -1.5,2.37 | smd 3.15 x 3.15: 29 0,0
14_PIN_OESIP = smd 0.75 x 0.35: P1 -1.193,2.409; P2 -1.193,1.609; P3 -1.193,0.809; P4 -1.193,0.009; P5 -1.193,-0.791; P6 -1.193,-1.591; P7 -1.193,-2.391; P8 1.207,-2.391; P9 1.207,-1.591; P10 1.207,-0.791; P11 1.207,0.009; P12 1.207,0.809; P13 1.207,1.609; P14 1.207,2.409
16_PIN_WLP = smd 0.22 x 0.22: 1 -0.532,0.518; 2 -0.182,0.518; 3 0.168,0.518; 4 0.518,0.518; 5 0.518,0.168; 6 0.518,-0.182; 7 0.518,-0.532; 8 0.168,-0.532; 9 -0.182,-0.532; 10 -0.532,-0.532; 11 -0.532,-0.182; 12 -0.532,0.168; 13 -0.182,0.168; 14 0.168,0.168; 15 0.168,-0.182; 16 -0.182,-0.182
MSOP8 = smd 0.4 x 1.1: 1 -0.975,-2.25; 2 -0.325,-2.25; 3 0.325,-2.25; 4 0.975,-2.25; 5 0.975,2.25; 6 0.325,2.25; 7 -0.325,2.25; 8 -0.975,2.25
SC70 = smd 0.4 x 0.75: 1 -0.65,-0.825; 2 0,-0.825; 3 0.65,-0.825; 4 0.65,0.825; 5 -0.65,0.825
SOT23-6 = smd 0.51 x 0.8: 1 -0.95,-1.3; 2 0,-1.3; 3 0.95,-1.3; 4 0.95,1.3; 5 0,1.3; 6 -0.95,1.3
RMARTIN-CUSTOM-LIBRARY_CAP_SENSOR_5X10 = smd 10 x 5: P$1 0,0
CRYSTAL-SMD-3.2X1.5MM = smd 1 x 1.8: P$1 -1.25,0; P$2 1.25,0

### Placement (x,y rotation side)
C1  33.02,3.81 270 top
C2  12.7,40.64 180 top
C3  12.7,36.83 0 top
C4  12.7,48.26 90 top
C5  35.56,20.32 0 top
C6  35.56,16.51 0 top
C7  3.81,22.86 90 top
C8  39.37,30.48 0 top
C10  2.54,33.02 0 top
C11  12.7,33.02 0 top
C12  41.91,20.32 0 top
C13  39.37,39.37 180 top
C14  48.26,40.64 270 top
C15  46.99,26.67 0 top
C16  17.78,8.89 90 top
C17  11.43,8.89 90 top
C18  17.78,3.81 270 top
C19  11.43,3.81 270 top
CN1  3.68,16.51 90 top
D1  25.4,20.32 0 top
D2  4.57,46.1 270 top
D3  7.62,22.99 270 top
D4  25.4,13.97 0 top
IC1  5.08,27.94 270 top
J2  2.54,6.35 270 top
L1  39.37,11.43 0 top
Q1  2.67,40.64 270 top
Q2  13.97,17.78 90 top
Q3  19.05,17.78 270 top
R1  38.1,48.26 90 top
R2  43.18,48.26 90 top
R3  10.16,48.26 90 top
R4  2.54,36.83 180 top
R5  48.26,48.26 90 top
R8  11.43,22.86 90 top
R9  45.72,9.4 90 top
R10  10.16,28.07 270 top
R11  16.51,13.97 180 top
R12  39.37,26.67 180 top
R13  7.62,33.02 180 top
R14  16.51,21.59 0 top
R15  45.72,3.81 90 top
R16  48.26,16.51 0 top
R17  41.91,16.51 0 top
R18  48.26,20.32 0 top
S1  11.43,44.45 0 top
U1  39.37,43.18 0 top
U2  25.4,37.59 0 top
U4  7.62,36.83 270 top
U5  25.4,6.35 0 top
U6  25.4,16.51 0 bottom
U7  44.45,39.37 0 top
U8  39.37,6.35 270 top
U9  46.99,30.48 90 top
U$1  39.37,34.29 270 top
U$2  25.4,29.21 0 bottom
Y2  45.72,44.45 0 top

### Tracks (layer width: path | path; a pad name or v marks a point on that pad's centre or on a via)
1.8V  (via drill 0.25, 0.35)
  Top 0.102: U7.3 44.62,41.36 44.07,41.91 42.76,41.91 41.49,40.64 | U9.5 44.45,31.55 44.45,34.29 v41.91,36.83 | v41.39,39.36 40.23,39.36 C13.1
  Top 0.152: R17.2 43.18,16.51 44.45,15.24 47.84,15.24 R16.2 R18.2 46.14,23.28 | 46.14,23.28 46.14,23.29 C15.1 46.16,26.7 U9.5 | 41.49,40.64 C13.1 | 46.14,23.28 44.02,23.28 C12.1 v39.37,20.32
  Route2 0.102: v41.91,36.83 41.91,38.83 v41.39,39.36
  Bottom 0.152: v39.37,20.32 26.67,20.32 25.4,19.05 25.4,17.15 24.77,16.52 U6.P11
3.3V  (via drill 0.1, 0.35)
  Top 0.102: U1.14 40.13,44.41 40.26,44.53 41.61,44.53 v41.91,44.83
  Top 0.152: v20.32,41.91 19.99,41.58 U2.2 14.49,41.58 C2.1 13.97,40.22 v13.97,39.37 | C3.1 9.87,36.83 U4.5 | C3.1 C11.1 | R3.2 9.11,49.11 v8.89,49.33 | C3.1 11.85,37.68 v11.43,38.1 | D1.1 20.65,21.92 v20.32,21.59 | D4.1 22.71,15.24 v20.32,15.24 | 34.38,6.02 U8.3 U8.2 36.5,6.68 35.56,7.62 35.56,10.16 36.83,11.43 L1.1 | 34.38,6.02 C1.1 | 34.38,6.02 33.02,7.39 v33.02,7.62 | U9.1 47.59,30.05 47.34,30.05 47.21,30.19 47.21,30.78 47.34,30.91 47.59,30.91 U9.3 48.71,31.13 v49.33,31.75 | R1.2 39.15,49.11 v39.37,49.33 | R2.2 44.23,49.11 v44.45,49.33 | R5.2 49.11,49.11 v49.33,49.33 | v41.91,34.29 U$1.5 U$1.6
  pour Route2 (isolate 0.254): 0,50.8 0,0 50.8,0 50.8,50.8
  pour Bottom (isolate 0.254): 0,50.8 0,0 50.8,0 50.8,50.8
5V  (via drill 0.35)
  Top 0.152: 45.62,10.25 R9.2 | C6.1 34.29,16.93 34.29,19.9 C5.1 | v33.02,15.24 34.29,16.51 C6.1 | C6.1 37.25,13.97 42,13.97 R9.2 | U8.7 42.23,6.68 43.18,7.62 43.18,8.89 44.54,10.25 R9.2
  Bottom 0.152: U6.P9 U6.P10 25.4,14.51 25.4,12.7 26.67,11.43 27.94,11.43 31.75,15.24 v33.02,15.24
DN
  Top 0.152: J2.A7 21.63,5.93 21.72,5.84 U5.5
  Bottom 0.152: J2.B7 5.71,6.77 J2.A7
DP
  Top 0.152: U5.4 6.99,6.35 J2.A6 5.71,5.93 J2.B6
DTR  (via drill 0.35)
  Top 0.152: R14.1 15.66,19.42 Q2.2 15.92,17.78 v16.51,17.78 | v20.32,10.16 21.76,8.72 U5.28
  Bottom 0.152: v16.51,17.78 20.32,13.97 v20.32,10.16
GND  (via drill 0.1, 0.25)  (2 unrouted)
  Top 0.102: U7.13 v44.26,39.54 | U1.5 36.83,40.86 v36.83,40.26 | U5.3 24.9,6.85 U5.29
  Route15 0.102: v36.83,40.26 39.75,43.18 v41.91,43.18
  Bottom 0.102: v44.26,39.54 44.19,39.47 44.15,39.47 44.05,39.37 43.18,39.37 v41.91,40.64
  Bottom 0.152: U6.P4 26.2,16.13 v25.53,16.13 | U6.P12 23.42,17.32 v22.73,16.64
  pour Top (isolate 0.254): 0,50.8 0,0 50.8,0 50.8,50.8
  pour Route15 (isolate 0.254): 0,50.8 0,0 50.8,0 50.8,50.8
GPIO0
  Top 0.152: Q2.3 12.87,21.76 14.6,23.5 31.75,23.5 33.9,25.64 U2.25
HR_INT  (via drill 0.3, 0.35)
  Top 0.152: R16.1 v45.72,16.51 44.45,17.78 v44.45,20.32 | U7.6 45,39.15 45.1,39.15 45.72,38.53 45.72,38.1 46.99,36.83 v46.99,35.56
  Bottom 0.152: U6.P13 23.2,18.12 21.59,16.51 21.59,15.24 26.67,10.16 29.21,10.16 34.29,15.24 44.45,15.24 v45.72,16.51 | v46.99,35.56 46.99,22.86 v44.45,20.32
LEDIN  (via drill 0.35)
  Top 0.152: v14.58,29.21 15.52,30.15 U2.11 | D1.4 28.09,21.59 29.97,21.59 30.48,22.1 v30.48,22.96
  Bottom 0.152: v30.48,22.96 29.94,23.5 15.87,23.5 14.58,24.79 v14.58,29.21
LEDIN2  (via drill 0.35)
  Top 0.152: v29.21,20.93 29.21,19.05 29.21,18.63 29.21,17.02 D4.4 | v13.97,30.48 14.91,31.42 U2.10
  Bottom 0.152: v29.21,20.93 27.28,22.86 15.24,22.86 13.97,24.13 v13.97,30.48
MFIO  (via drill 0.1, 0.3)
  Top 0.152: U2.14 17.23,26.67 19.05,26.67 20.32,27.94 20.32,38.1 21.59,39.37 27.94,39.37 30.48,36.83 v30.48,34.29
  Bottom 0.152: v30.48,34.29 36.83,27.94 40.64,27.94 44.27,31.57 U7.16
  other vias: 44.27,39.19
N$1  (via drill 0.35)
  Top 0.152: U4.3 6.41,35.79 v6.41,34.35 | R4.1 2.54,35.98 v2.54,34.29
  Bottom 0.152: v6.41,34.35 5.08,33.02 3.81,33.02 v2.54,34.29
N$3
  Top 0.152: U8.5 42.34,4.66 R15.2 46.99,5.93 46.99,7.28 R9.1
N$4  (via drill 0.35)
  Top 0.152: C10.1 R4.2 1.67,36.85 Q1.2 2.54,40.56 v2.54,40.64 | U4.1 6.32,39.34 v6.35,39.37 | D2.C 2.54,46.27 v2.54,43.18
  Bottom 0.152: v6.35,39.37 5.08,40.64 v2.54,40.64 v2.54,43.18
N$5  (via drill 0.35)
  Top 0.152: IC1.5 6.35,28.92 v6.35,30.48 | v8.89,31.75 10.16,30.48 R10.1
  Bottom 0.152: v6.35,30.48 7.62,31.75 v8.89,31.75
N$6
  Top 0.152: U1.8 40.06,41.95 40.24,41.78 41.78,41.78 43.18,43.18 43.18,45.72 44.87,47.41 R5.1
N$7  (via drill 0.35)
  Top 0.152: R8.2 10.58,23.71 v8.89,25.4 | IC1.1 3.84,28.83 v5.08,28.83
  Bottom 0.152: v5.08,28.83 5.97,27.94 7.62,27.94 8.89,26.67 v8.89,25.4
N$8
  Top 0.152: U$1.4 40.67,30.93 C8.2
N$9
  Top 0.152: Q2.1 15.66,16.14 R11.2
N$10
  Top 0.152: Q3.1 17.36,19.42 R14.2
N$11
  Top 0.152: D3.C 7.72,22.01 R8.1
N$12
  Top 0.152: U$1.3 38.07,30.93 38.31,30.69 C8.1 40.22,28.78 R12.1
N$15  (via drill 0.35)
  Top 0.152: R12.2 v36.83,26.67
  Bottom 0.152: v36.83,26.67 34.29,26.67 31.75,29.21 U$2.P$1
N$16
  Top 0.152: 40.27,11.06 L1.2 41.27,11.43 41.91,10.8 41.91,10.16 41.27,9.52 36.83,9.52 36.2,8.89 36.2,7.62 36.49,7.33 U8.1
N$17
  Top 0.152: U7.4 46.57,41.49 C14.1
N$18  (via drill 0.3)
  Top 0.152: Y2.P$1 44.47,43.2 v44.45,43.18 | v43.18,41.15 43.18,40.63 U7.1
  Bottom 0.152: v44.45,43.18 44.45,42.42 v43.18,41.15
N$19  (via drill 0.3)
  Top 0.152: U7.2 44.23,39.92 44.23,40.02 44.21,40.03 v44.21,40.64 | v46.99,42.55 47.62,43.18 47.62,43.8 Y2.P$2
  Bottom 0.152: v44.21,40.64 46.12,42.55 v46.99,42.55
N$20  (via drill 0.35)
  Top 0.152: U5.6 23.01,5.33 v20.32,5.33 | v19.05,7.24 18.25,8.04 C16.1 C17.1
  Bottom 0.152: v20.32,5.33 19.05,6.6 v19.05,7.24
RESET  (via drill 0.35)
  Top 0.152: S1.4 9.38,46.63 R3.1 C4.1 13.48,46.63 S1.3 12.68,44.45 v11.43,44.45 | Q3.3 17.78,17.78 v16.51,19.05 | v13.97,34.92 15.24,36.2 15.24,39.37 16.18,40.31 16.51,40.31 U2.3 18.36,40.31 19.3,39.37 20.7,39.37 20.96,39.62 20.96,40.26 20.57,40.64 v20.32,40.64
  Bottom 0.152: v11.43,44.45 10.92,43.94 10.92,42.04 12.32,40.64 v20.32,40.64 | v16.51,19.05 12.7,22.86 12.7,33.66 v13.97,34.92
RST  (via drill 0.3)
  Top 0.152: U7.12 42.46,39.54 v41.53,38.61 | v36.4,31.75 36.07,31.42 U2.29
  Bottom 0.152: v41.53,38.61 39.37,36.45 39.37,34.29 36.83,31.75 v36.4,31.75
RTS  (via drill 0.35)
  Top 0.152: Q3.2 17.36,16.14 R11.1 17.36,12.28 v15.24,10.16 | U5.24 26.04,8.86 26.04,9.26 26.94,10.16 29.21,10.16 30.48,8.89 30.48,2.54 29.21,1.27 16.51,1.27 v15.24,2.54
  Bottom 0.152: v15.24,2.54 v15.24,10.16
RXD  (via drill 0.35)
  Top 0.152: U5.25 v25.4,10.16 | U2.34 35.89,37.77 v36.83,36.83
  Route15 0.152: v25.4,10.16 25.4,16.26 26.92,17.78 31.75,17.78 35.56,21.59 35.56,26.67 36.83,27.94 v36.83,36.83
SCL
  Top 0.152: U1.4 38.05,42.58 37.79,42.58 37.16,41.96 | U2.36 35.52,40.31 35.56,40.35 | 37.16,41.96 35.7,40.5 35.56,40.35 | R2.1 41.49,45.72 38.1,45.72 37.16,44.78 37.16,41.96 | U7.10 43.18,38.1 36.83,38.1 35.56,39.37 35.56,40.35
SDA  (via drill 0.3, 0.35)
  Top 0.152: U2.37 35.23,41.58 v35.56,41.91 35.56,42.8 36.73,43.97 36.73,46.04 R1.1 | v40.64,40.64 v38.1,40.64 37.85,40.89 37.85,41.15 38.1,41.4 38.32,41.4 U1.6 | U7.9 44.23,38.8 44.23,38.71 43.81,38.29 v43.81,37.47
  Bottom 0.152: v35.56,41.91 36.83,40.64 v38.1,40.64 | v40.64,40.64 v43.81,37.47
SNSR_SCL  (via drill 0.3, 0.35)
  Top 0.152: R18.1 46.14,19.05 v45.72,19.05 | U7.5 46.82,39.54 50.16,36.2 50.16,23.5 v49.53,22.86
  Bottom 0.152: U6.P2 44.79,18.12 v45.72,19.05 45.72,20.32 46.99,21.59 48.26,21.59 v49.53,22.86
SNSR_SDA  (via drill 0.1, 0.3, 0.35)
  Top 0.152: v39.37,16.51 R17.1 41.91,17.36 v41.91,19.05
  Bottom 0.102: U7.14 45.55,39.54 45.72,39.37
  Bottom 0.152: U6.P3 27.51,17.32 28.32,16.51 v39.37,16.51 | 45.72,39.37 45.72,22.86 v41.91,19.05
  other vias: 44.62,39.54
TXD  (via drill 0.35)
  Top 0.152: U5.26 24.76,8.86 24.76,9.26 24.13,9.89 v24.13,10.16 | v31.75,38.1 32.69,39.04 U2.35
  Route15 0.152: v24.13,10.16 24.13,17.78 31.75,25.4 v31.75,38.1
V_BATT
  Top 0.152: Q1.3 4.45,39.96 4.45,31.75 3.18,30.48 1.9,30.48 1.27,29.84 1.27,27.94 2.22,26.99 IC1.3 4.45,26.33 4.45,25.4 3.94,24.89 3.3,24.89 2.54,24.13 2.54,23.28 C7.1 4.45,21.38 4.45,16.51 5.45,15.51 CN1.2
V_USB  (via drill 0.35)
  Top 0.152: 18,4.45 C18.1
  Top 0.254: v8.89,8.89 8.47,8.48 J2.A4 J2.B9 4.66,8.48 3.81,7.62 3.81,5.08 4.66,4.23 J2.B4 J2.A9 9.94,4.23 10.38,4.66 C19.1 C18.1 21.42,4.66 21.61,4.85 U5.7 U5.8 | 7.35,23.86 D3.A
  Top 0.305: Q1.1 2.26,41.59 D2.A 4.57,42.42 5.08,41.91 5.08,34.71 R13.2 6.77,31.33 7.62,30.48 7.62,28.23 IC1.4 6.38,24.16 6.35,24.13 | 6.35,24.13 6.62,23.86 D3.A | v6.35,22.86 6.35,24.13
  Bottom 0.254: v6.35,22.86 6.35,17.78 8.89,15.24 v8.89,8.89
(copper drawn outside any net)
  shapes: Top area x2